# Altium schematic sheet main.SchDoc
size A3
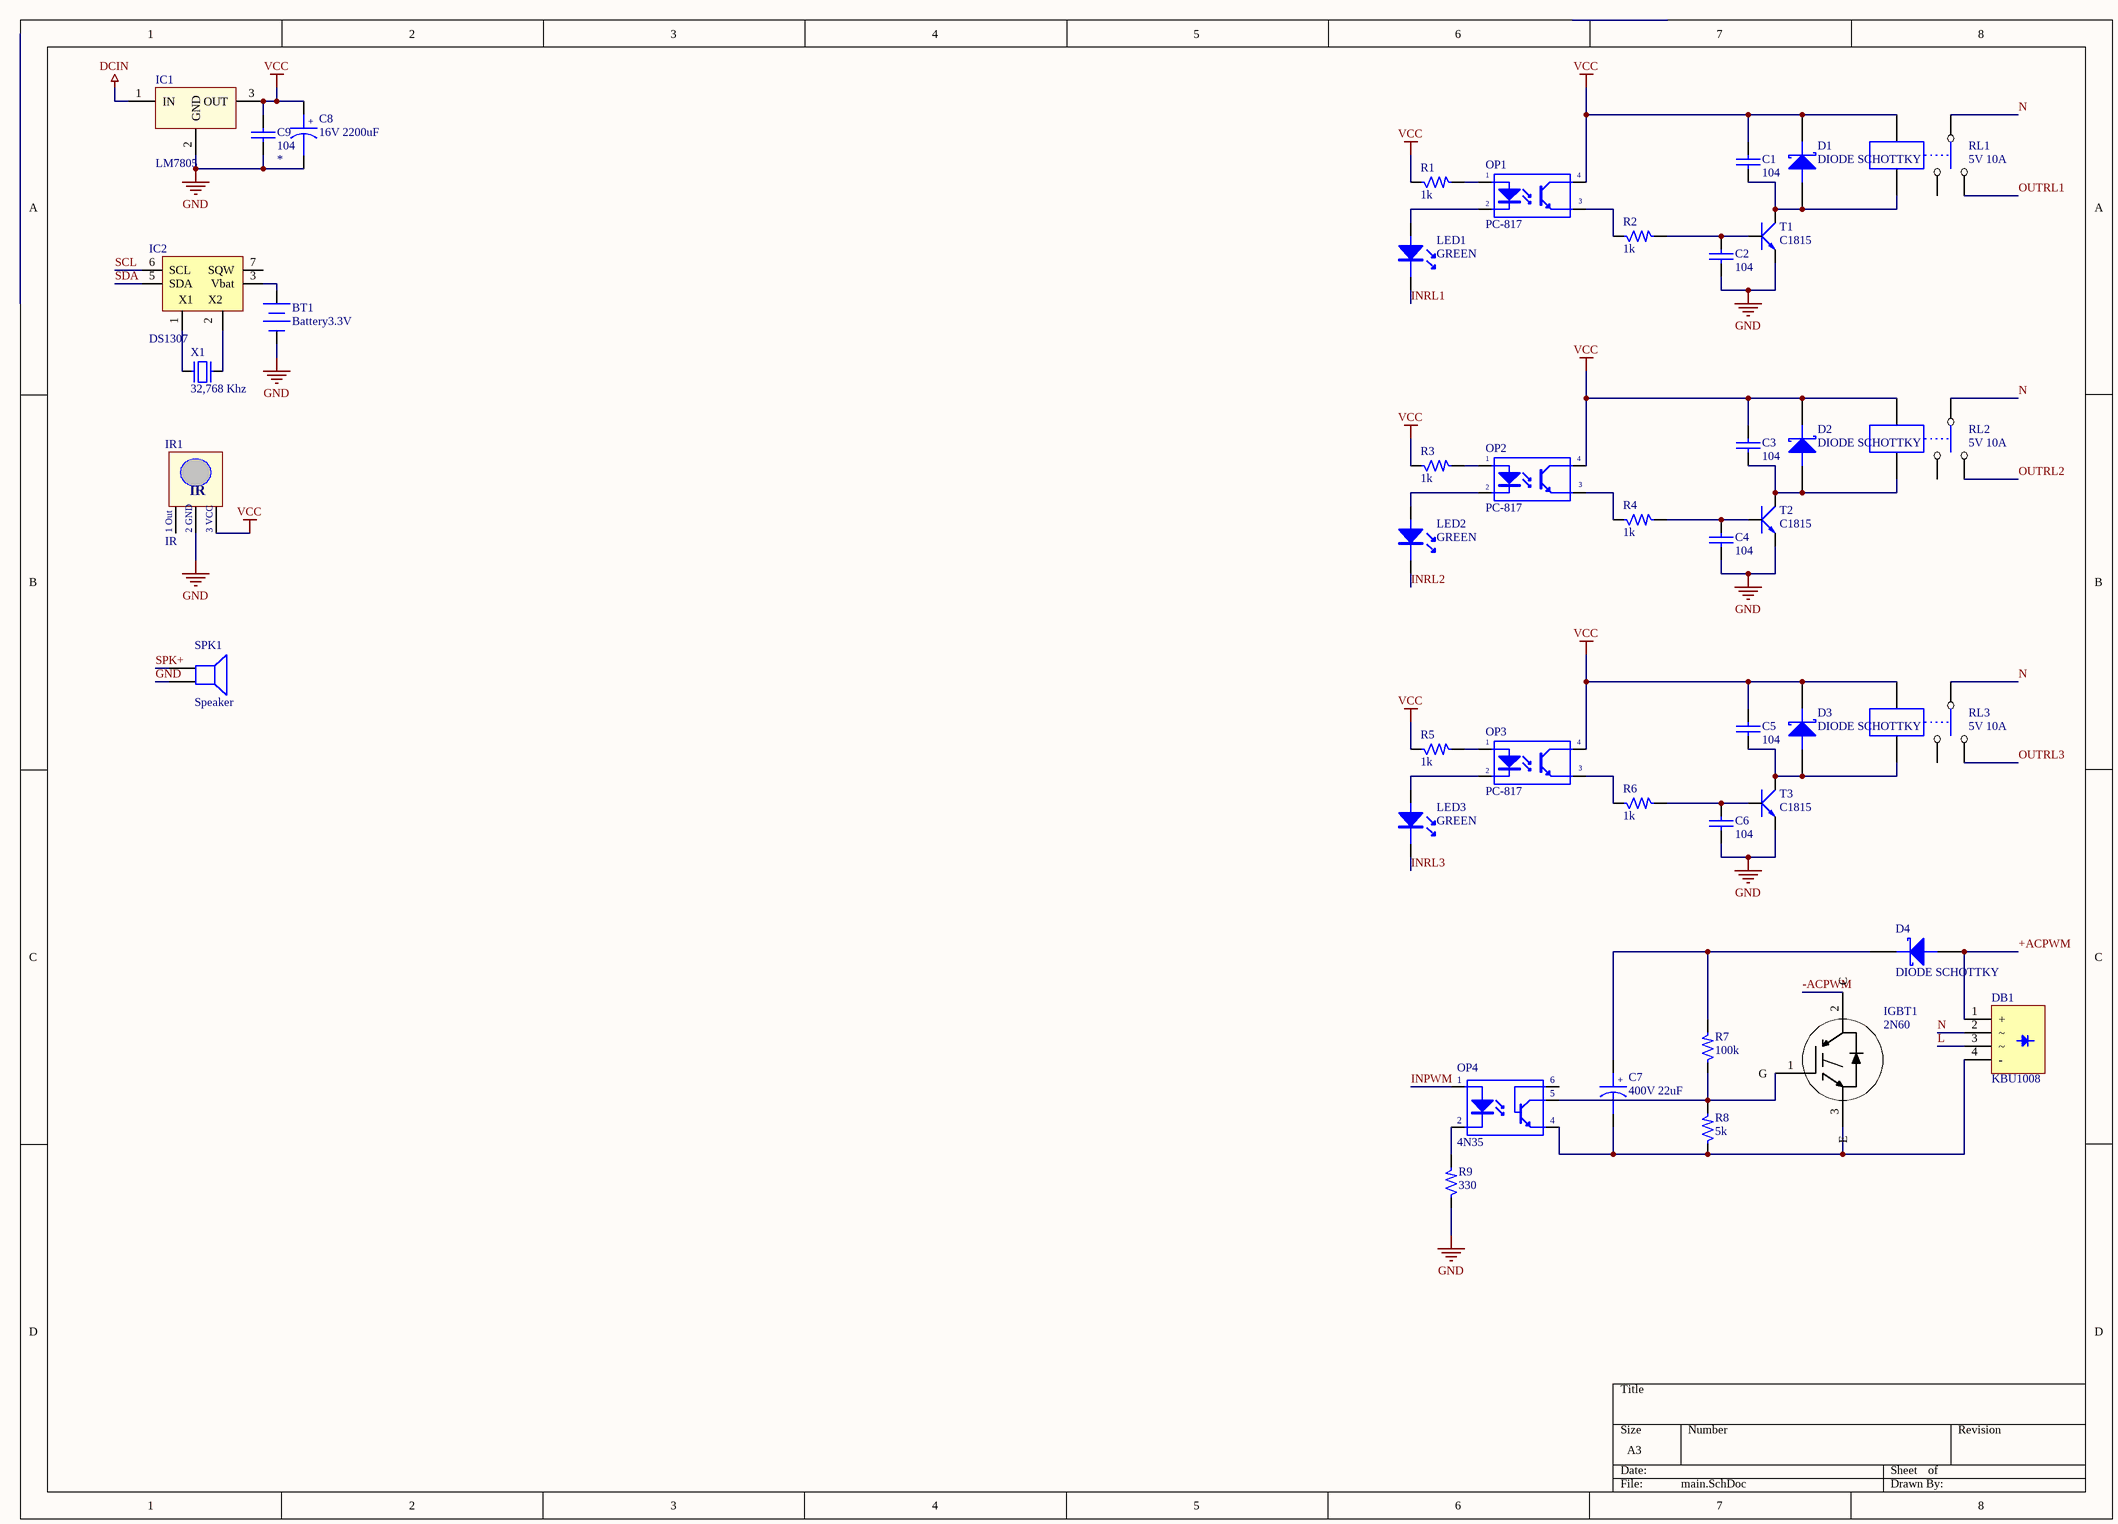
[diagram p0: main.SchDoc]

## Parts
BT1  Battery3.3V  [CR2032 Holder]
C1  104  [CAP-SMD-0805]
C2  104  [CAP-SMD-0805]
C3  104  [CAP-SMD-0805]
C4  104  [CAP-SMD-0805]
C5  104  [CAP-SMD-0805]
C6  104  [CAP-SMD-0805]
C7  400V 22uF  [CAPP-12mm]
C8  16V 2200uF  [CAPP-10mm]
C9  104  [CAP-SMD-0805]
D1  DIODE SCHOTTKY  [SMA]
D2  DIODE SCHOTTKY  [SMA]
D3  DIODE SCHOTTKY  [SMA]
D4  DIODE SCHOTTKY  [SMA]
DB1  KBU1008  [DIODE BRIDGE(FLAT) BIG]
IC1  LM7805  [QTO-220H3]
IC2  DS1307  [DIP8/W0.3]
IGBT1  2N60  [QTO-247]
IR1  IR  [IR]
LED1  GREEN  [LED-3mm - green]
LED2  GREEN  [LED-3mm - green]
LED3  GREEN  [LED-3mm - green]
OP1  PC-817  [OPTO-SMD-PC817x1]
OP2  PC-817  [OPTO-SMD-PC817x1]
OP3  PC-817  [OPTO-SMD-PC817x1]
OP4  4N35  [DIP6 - white]
R1  1k  [R-SMD-0805]
R2  1k  [R-SMD-0805]
R3  1k  [R-SMD-0805]
R4  1k  [R-SMD-0805]
R5  1k  [R-SMD-0805]
R6  1k  [R-SMD-0805]
R7  100k  [DIEN TRO 1/4 W]
R8  5k  [DIEN TRO 1/4 W]
R9  330  [R-SMD-0805]
RL1  5V 10A  [RL_SPDT_10A]
RL2  5V 10A  [RL_SPDT_10A]
RL3  5V 10A  [RL_SPDT_10A]
SPK1  Speaker  [SPEAKER-Chip]
T1  C1815  [SOT23B]
T2  C1815  [SOT23B]
T3  C1815  [SOT23B]
X1  32,768 Khz  [XT32k]

## Nets
DCIN: IC1.1(IN)
GND: BT1.2(-) C2.2 C4.2 C6.2 C8.2 C9.2 IC1.2(GND) IC2.4(GND) IR1.2(GND) R9.1 SPK1.2 T1.1(E) T2.1(E) T3.1(E)
VCC: C1.1 C3.1 C5.1 C8.1 C9.1 D1.2(K) D2.2(K) D3.2(K) IC1.3(OUT) IC2.8(VCC) IR1.3(VCC) OP1.4(C) OP2.4(C) OP3.4(C) R1.1 R3.1 R5.1 RL1.5 RL2.5 RL3.5
+ACPWM: D4.1(A) DB1.1(+)
INPWM: OP4.1(A)
INRL1: LED1.2
INRL2: LED2.2
INRL3: LED3.2
L: DB1.3
N: DB1.2 RL1.1 RL2.1 RL3.1
OUTRL1: RL1.3
OUTRL2: RL2.3
OUTRL3: RL3.3
SCL: IC2.6(SCL)
SDA: IC2.5(SDA)
SPK+: SPK1.1
NetBT1_1: BT1.1(+) IC2.3(Vbat)
NetC1_2: C1.2 D1.1(A) RL1.4 T1.2(C)
NetC2_1: C2.1 R2.2 T1.3(B)
NetC3_2: C3.2 D2.1(A) RL2.4 T2.2(C)
NetC4_1: C4.1 R4.2 T2.3(B)
NetC5_2: C5.2 D3.1(A) RL3.4 T3.2(C)
NetC6_1: C6.1 R6.2 T3.3(B)
NetC7_1: C7.1 D4.2(K) R7.2
NetC7_2: C7.2 DB1.4(-) OP4.4(E) R8.1
NetIC2_1: IC2.1(X1) X1.1
NetIC2_2: IC2.2(X2) X1.2
NetLED1_1: LED1.1 OP1.2(K)
NetLED2_1: LED2.1 OP2.2(K)
NetLED3_1: LED3.1 OP3.2(K)
NetOP1_1: OP1.1(A) R1.2
NetOP1_3: OP1.3(E) R2.1
NetOP2_1: OP2.1(A) R3.2
NetOP2_3: OP2.3(E) R4.1
NetOP3_1: OP3.1(A) R5.2
NetOP3_3: OP3.3(E) R6.1
NetOP4_2: OP4.2(K) R9.2
NetOP4_5: OP4.5(C) R7.1 R8.2

Not connected (* = marked no-connect by the designer): IC2 7(SQW); IGBT1 1(G) 2(C) 3(E); IR1 1(Out); OP4 6(C); RL1 2; RL2 2; RL3 2

## Notes on the sheet
- (in symbol CAP POL) +
- (in symbol IR) 1 Out; 2 GND; 3 VCC

## Library data of the parts
BT1 = Battery3.3V: Multicell Battery; Published: 24-Mar-1999; LatestRevisionDate: 17-Jul-2002; LatestRevisionNote: Re-released for DXP Platform.; PackageReference: BAT-2; Publisher: Altium Limited
C1-C6 C9 = CAP: Capacitor
  C1 C3 C5 C9: Footprint: *
C7 C8 = CAP POL
D1-D4 = DIODE SCHOTTKY: Schottky Diode
DB1 = Diode Bridge KBU1008: Diode Bridge
IC1 = LM78xx: On ap +, from + 5 to + 24VDC; Value: LM7805
IC2 = DS1307: Real Timer Serial; Value: DS1307
IGBT1 = IGBT-2N60
IR1 = IR: Receiver Infraed IC
LED1-LED3 = LED
OP1-OP3 = Opto 1: Single; Value: TLP5211
R1-R9 = RES: Resistor 1/4W; Value: R1/4W - 1K
RL1-RL3 = RELAY-SPDT
SPK1 = Speaker: Loudspeaker; Published: 24-Mar-1999; LatestRevisionDate: 17-Jul-2002; LatestRevisionNote: Re-released for DXP Platform.; PackageReference: PIN2; Publisher: Altium Limited
T1-T3 = C1815: NPN 600mW, ECB; Value: C1815
X1 = XT32k: Crystal 32,768kHz for timer real; Value: 32,768khz